# Altium schematic sheet MODEM.SchDoc: RF
size 420 x 297 mm; SheetNumber: 4
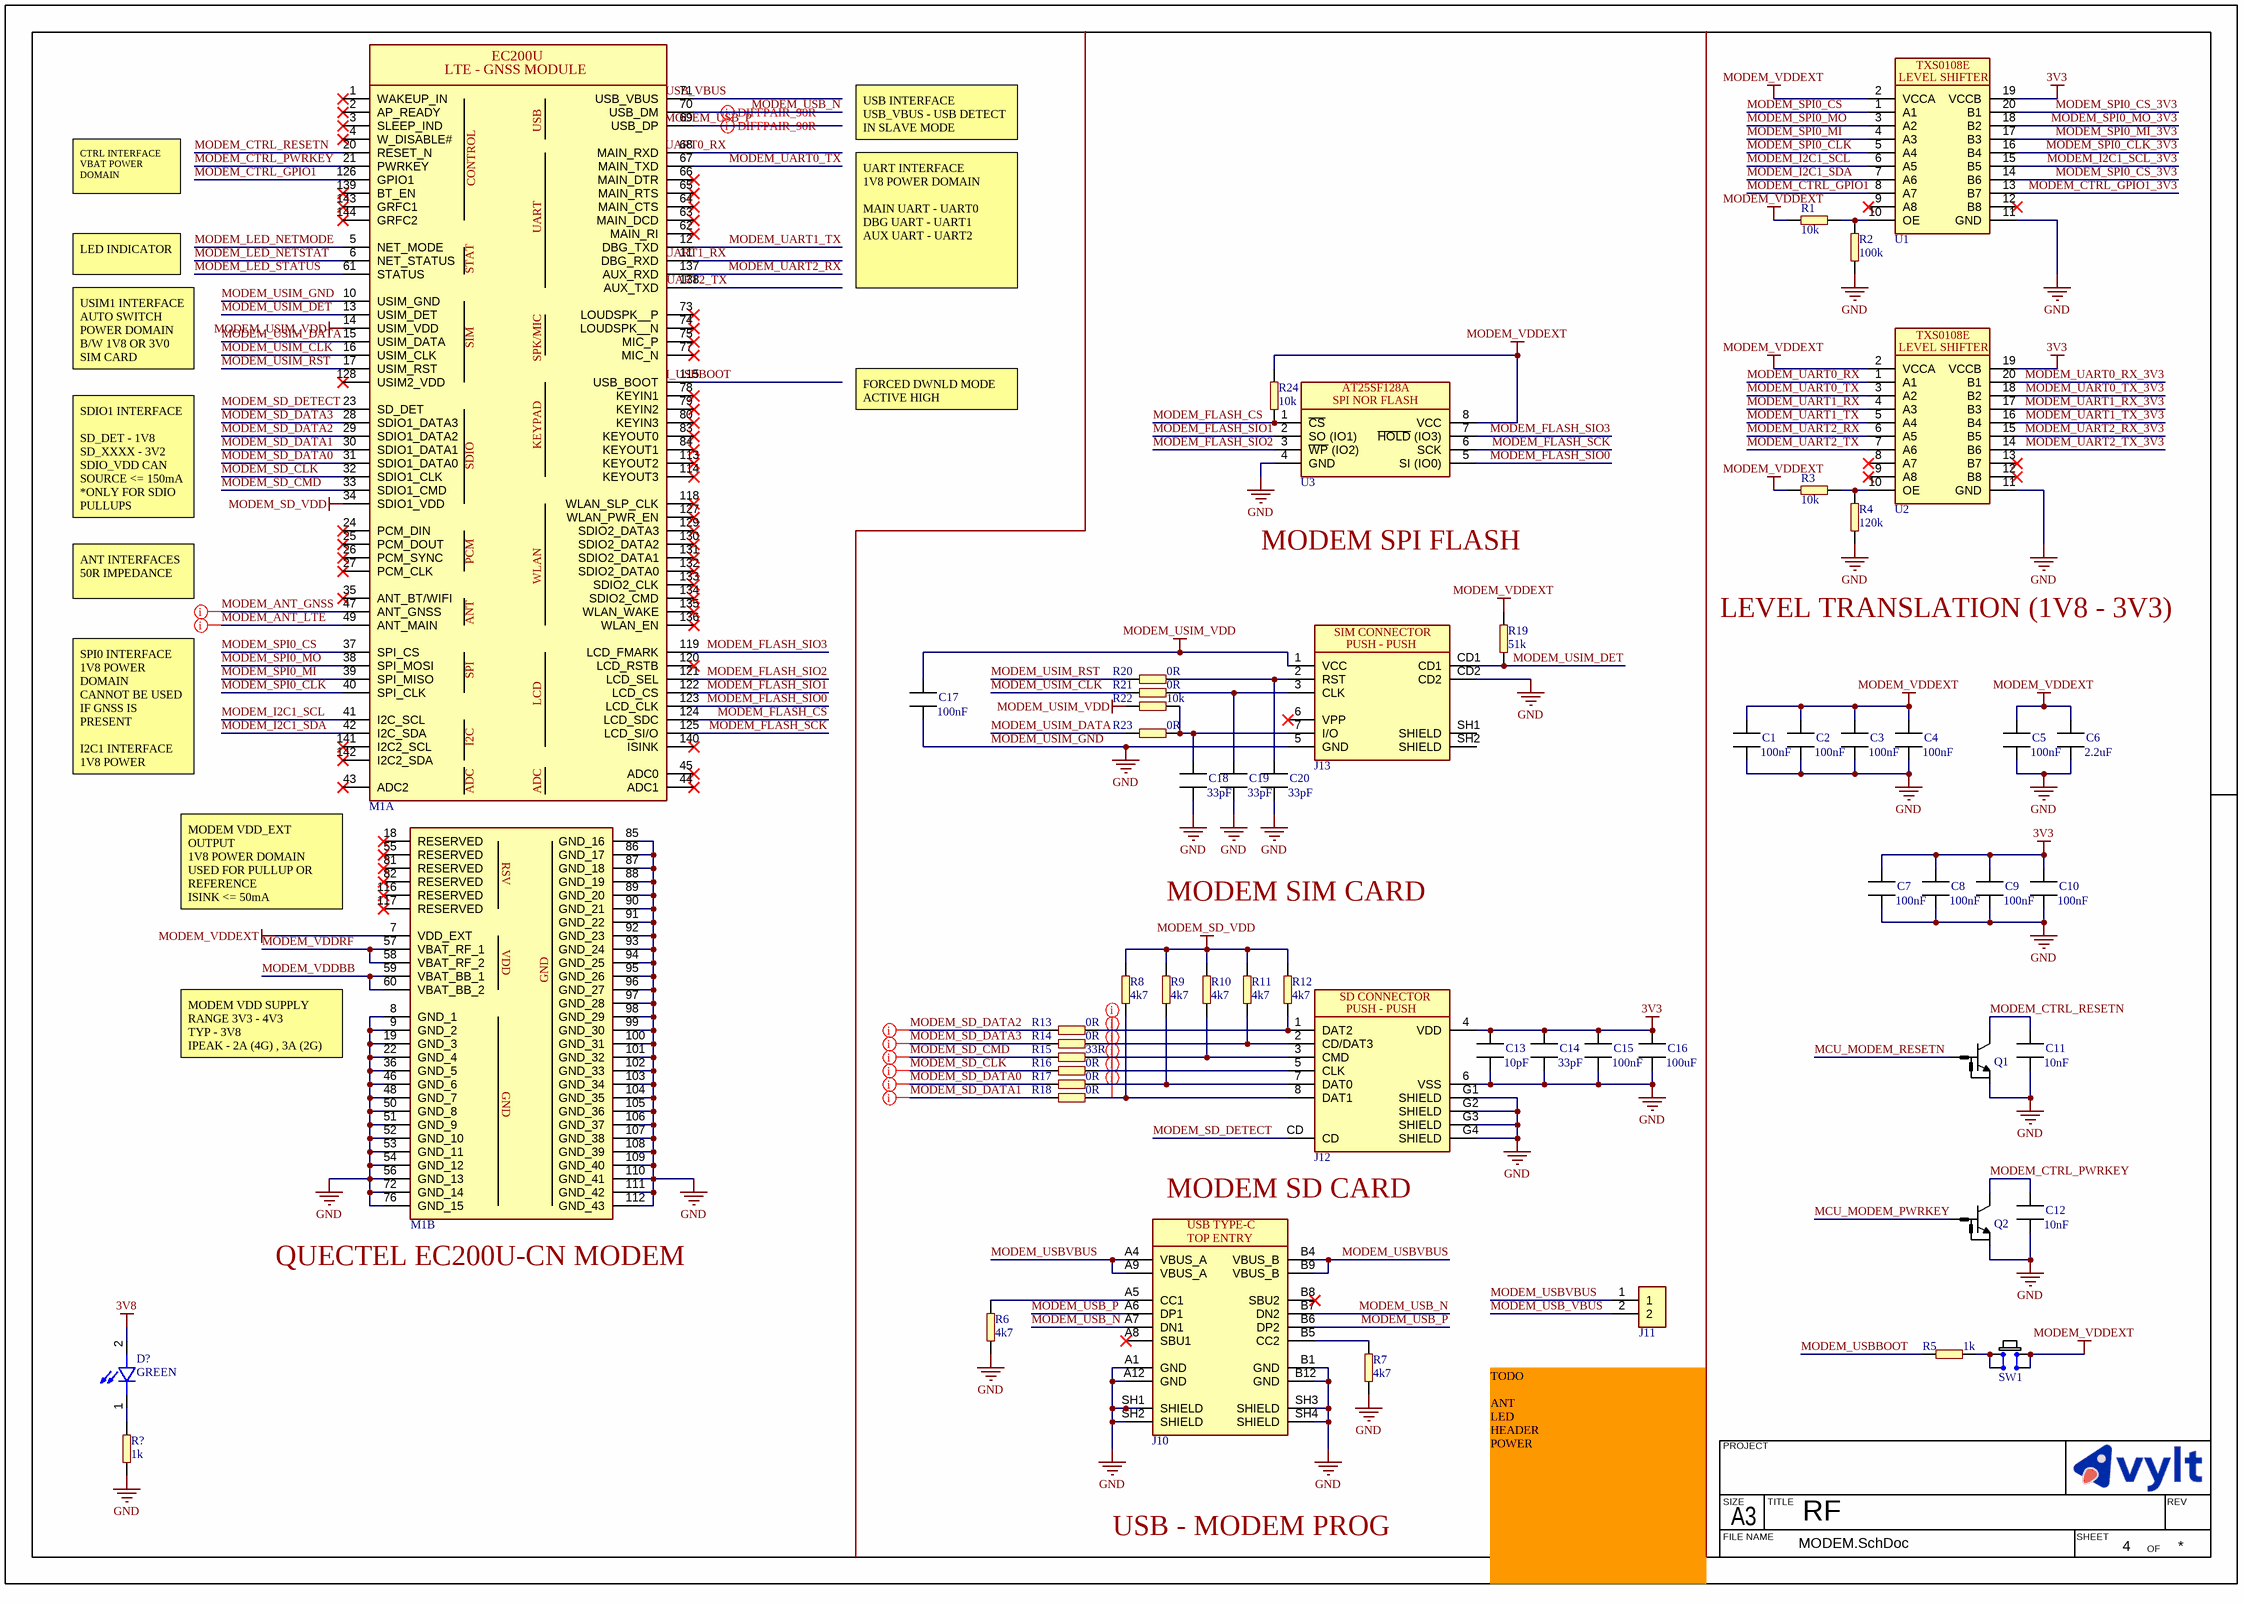
[diagram p0: MODEM.SchDoc]

## Parts
C1  value 100nF  [CAPC2012X13L]  (hidden comment: MLCC_0805)
C2  value 100nF  [CAPC2012X13L]  (hidden comment: MLCC_0805)
C3  value 100nF  [CAPC2012X13L]  (hidden comment: MLCC_0805)
C4  value 100nF  [CAPC2012X13L]  (hidden comment: MLCC_0805)
C5  value 100nF  [CAPC2012X13L]  (hidden comment: MLCC_0805)
C6  value 2.2uF  [CAPC2012X13L]  (hidden comment: MLCC_0805)
C7  value 100nF  [CAPC2012X13L]  (hidden comment: MLCC_0805)
C8  value 100nF  [CAPC2012X13L]  (hidden comment: MLCC_0805)
C9  value 100nF  [CAPC2012X13L]  (hidden comment: MLCC_0805)
C10  value 100nF  [CAPC2012X13L]  (hidden comment: MLCC_0805)
C11  value 10nF  [CAPC2012X13L]  (hidden comment: MLCC_0805)
C12  value 10nF  [CAPC2012X13L]  (hidden comment: MLCC_0805)
C13  value 10pF  [CAPC2012X13L]  (hidden comment: MLCC_0805)
C14  value 33pF  [CAPC2012X13L]  (hidden comment: MLCC_0805)
C15  value 100nF  [CAPC2012X13L]  (hidden comment: MLCC_0805)
C16  value 100uF  [CAPC2012X13L]  (hidden comment: MLCC_0805)
C17  value 100nF  [CAPC2012X13L]  (hidden comment: MLCC_0805)
C18  value 33pF  [CAPC2012X13L]  (hidden comment: MLCC_0805)
C19  value 33pF  [CAPC2012X13L]  (hidden comment: MLCC_0805)
C20  value 33pF  [CAPC2012X13L]  (hidden comment: MLCC_0805)
D?  value GREEN  [LED_1206_TOP]  (hidden comment: LED_1206_TOP)
J10  GSB1CA11101DSHR  [GSB1CA11101DSHR]  (value not drawn)
J11  2PX1R  [2PX1R]  (value not drawn)
J12  MSD-4-A  [MSD-4-A]  (value not drawn)
J13  SIM-11-A  [SIM-11-A]  (value not drawn)
M1  EC200U  [EC200U]  (value not drawn)  (parts A,B of 2)
Q1  PDTD143  [SOT95P230X110-3L]  (value not drawn)
Q2  PDTD143  [SOT95P230X110-3L]  (value not drawn)
R1  value 10k  [RES_0603]  (hidden comment: ERP_101-1)
R2  value 100k  [RES_0603]  (hidden comment: ERP_101-1)
R3  value 10k  [RES_0603]  (hidden comment: ERP_101-1)
R4  value 120k  [RES_0603]  (hidden comment: ERP_101-1)
R5  value 1k  [RES_0603]  (hidden comment: ERP_101-1)
R6  value 4k7  [RES_0603]  (hidden comment: ERP_101-1)
R7  value 4k7  [RES_0603]  (hidden comment: ERP_101-1)
R8  value 4k7  [RES_0603]  (hidden comment: ERP_101-1)
R9  value 4k7  [RES_0603]  (hidden comment: ERP_101-1)
R10  value 4k7  [RES_0603]  (hidden comment: ERP_101-1)
R11  value 4k7  [RES_0603]  (hidden comment: ERP_101-1)
R12  value 4k7  [RES_0603]  (hidden comment: ERP_101-1)
R13  value 0R  [RES_0603]  (hidden comment: ERP_101-1)
R14  value 0R  [RES_0603]  (hidden comment: ERP_101-1)
R15  value 33R  [RES_0603]  (hidden comment: ERP_101-1)
R16  value 0R  [RES_0603]  (hidden comment: ERP_101-1)
R17  value 0R  [RES_0603]  (hidden comment: ERP_101-1)
R18  value 0R  [RES_0603]  (hidden comment: ERP_101-1)
R19  value 51k  [RES_0603]  (hidden comment: ERP_101-1)
R20  value 0R  [RES_0603]  (hidden comment: ERP_101-1)
R21  value 0R  [RES_0603]  (hidden comment: ERP_101-1)
R22  value 10k  [RES_0603]  (hidden comment: ERP_101-1)
R23  value 0R  [RES_0603]  (hidden comment: ERP_101-1)
R24  value 10k  [RES_0603]  (hidden comment: ERP_101-1)
R?  value 1k  [RES_0603]  (hidden comment: ERP_101-1)
SW1  PTS647  [PTS647]  (value not drawn)
U1  TXS0108EPW  [TXS0108EPW]  (value not drawn)
U2  TXS0108EPW  [TXS0108EPW]  (value not drawn)
U3  AT25SF128A  [SOIC127P800X216-8L]  (value not drawn)

## Nets
3V3: C7.1 C8.1 C9.1 C10.1 C13.1 C14.1 C15.1 C16.1 J12.4(VDD) U1.19(VCCB) U2.19(VCCB)
3V8: D?.2
MODEM_SD_VDD: M1.34(SDIO1_VDD) R8.2 R9.2 R10.2 R11.2 R12.2
MODEM_USIM_GND: C1.2 C2.2 C3.2 C4.2 C5.2 C6.2 C7.2 C8.2 C9.2 C10.2 C11.2 C12.2 C13.2 C14.2 C15.2 C16.2 C17.2 C18.2 C19.2 C20.2 J10.A1(GND) J10.A12(GND) J10.B1(GND) J10.B12(GND) J10.SH1(SHIELD) J10.SH2(SHIELD) J10.SH3(SHIELD) J10.SH4(SHIELD) J12.6(VSS) J12.G1(SHIELD) J12.G2(SHIELD) J12.G3(SHIELD) J12.G4(SHIELD) J13.5(GND) J13.CD2 M1.8(GND_1) M1.9(GND_2) M1.10(USIM_GND) M1.19(GND_3) M1.22(GND_4) M1.36(GND_5) M1.46(GND_6) M1.48(GND_7) M1.50(GND_8) M1.51(GND_9) M1.52(GND_10) M1.53(GND_11) M1.54(GND_12) M1.56(GND_13) M1.72(GND_14) M1.76(GND_15) M1.85(GND_16) M1.86(GND_17) M1.87(GND_18) M1.88(GND_19) M1.89(GND_20) M1.90(GND_21) M1.91(GND_22) M1.92(GND_23) M1.93(GND_24) M1.94(GND_25) M1.95(GND_26) M1.96(GND_27) M1.97(GND_28) M1.98(GND_29) M1.99(GND_30) M1.100(GND_31) M1.101(GND_32) M1.102(GND_33) M1.103(GND_34) M1.104(GND_35) M1.105(GND_36) M1.106(GND_37) M1.107(GND_38) M1.108(GND_39) M1.109(GND_40) M1.110(GND_41) M1.111(GND_42) M1.112(GND_43) Q1.2 Q2.2 R2.2 R4.2 R6.2 R7.2 R?.1 U1.11(GND) U2.11(GND) U3.4(GND)  [also labelled GND]
MODEM_USIM_VDD: C17.1 J13.1(VCC) M1.14(USIM_VDD) R22.2
MODEM_VDDEXT: C1.1 C2.1 C3.1 C4.1 C5.1 C6.1 M1.7(VDD_EXT) R1.2 R3.2 R19.2 R24.2 SW1.3(COM) SW1.4(COM) U1.2(VCCA) U2.2(VCCA) U3.8(VCC)
MCU_MODEM_PWRKEY: Q2.1
MCU_MODEM_RESETN: Q1.1
MODEM_ANT_GNSS: M1.47(ANT_GNSS)
MODEM_ANT_LTE: M1.49(ANT_MAIN)
MODEM_CTRL_GPIO1: M1.126(GPIO1) U1.8(A7)
MODEM_CTRL_GPIO1_3V3: U1.13(B7)
MODEM_CTRL_PWRKEY: C12.1 M1.21(PWRKEY) Q2.3
MODEM_CTRL_RESETN: C11.1 M1.20(RESET_N) Q1.3
MODEM_FLASH_CS: M1.124(LCD_SDC) R24.1 U3.1(~{CS})
MODEM_FLASH_SCK: M1.125(LCD_SI/O) U3.6(SCK)
MODEM_FLASH_SIO0: M1.123(LCD_CLK) U3.5(SI_(IO0))
MODEM_FLASH_SIO1: M1.122(LCD_CS) U3.2(SO_(IO1))
MODEM_FLASH_SIO2: M1.121(LCD_SEL) U3.3(~{WP}_(IO2))
MODEM_FLASH_SIO3: M1.119(LCD_FMARK) U3.7(~{HOLD}_(IO3))
MODEM_I2C1_SCL: M1.41(I2C_SCL) U1.6(A5)
MODEM_I2C1_SCL_3V3: U1.15(B5)
MODEM_I2C1_SDA: M1.42(I2C_SDA) U1.7(A6)
MODEM_LED_NETMODE: M1.5(NET_MODE)
MODEM_LED_NETSTAT: M1.6(NET_STATUS)
MODEM_LED_STATUS: M1.61(STATUS)
MODEM_SD_CLK: M1.32(SDIO1_CLK) R16.2
MODEM_SD_CMD: M1.33(SDIO1_CMD) R15.2
MODEM_SD_DATA0: M1.31(SDIO1_DATA0) R17.2
MODEM_SD_DATA1: M1.30(SDIO1_DATA1) R18.2
MODEM_SD_DATA2: M1.29(SDIO1_DATA2) R13.2
MODEM_SD_DATA3: M1.28(SDIO1_DATA3) R14.2
MODEM_SD_DETECT: J12.CD M1.23(SD_DET)
MODEM_SPI0_CLK: M1.40(SPI_CLK) U1.5(A4)
MODEM_SPI0_CLK_3V3: U1.16(B4)
MODEM_SPI0_CS: M1.37(SPI_CS) U1.1(A1)
MODEM_SPI0_CS_3V3: U1.14(B6) U1.20(B1)
MODEM_SPI0_MI: M1.39(SPI_MISO) U1.4(A3)
MODEM_SPI0_MI_3V3: U1.17(B3)
MODEM_SPI0_MO: M1.38(SPI_MOSI) U1.3(A2)
MODEM_SPI0_MO_3V3: U1.18(B2)
MODEM_UART0_RX: M1.68(MAIN_RXD) U2.1(A1)
MODEM_UART0_RX_3V3: U2.20(B1)
MODEM_UART0_TX: M1.67(MAIN_TXD) U2.3(A2)
MODEM_UART0_TX_3V3: U2.18(B2)
MODEM_UART1_RX: M1.11(DBG_RXD) U2.4(A3)
MODEM_UART1_RX_3V3: U2.17(B3)
MODEM_UART1_TX: M1.12(DBG_TXD) U2.5(A4)
MODEM_UART1_TX_3V3: U2.16(B4)
MODEM_UART2_RX: M1.137(AUX_RXD) U2.6(A5)
MODEM_UART2_RX_3V3: U2.15(B5)
MODEM_UART2_TX: M1.138(AUX_TXD) U2.7(A6)
MODEM_UART2_TX_3V3: U2.14(B6)
MODEM_USB_N: J10.A7(DN1) J10.B7(DN2) M1.70(USB_DM)
MODEM_USB_P: J10.A6(DP1) J10.B6(DP2) M1.69(USB_DP)
MODEM_USB_VBUS: J11.2 M1.71(USB_VBUS)
MODEM_USBBOOT: M1.115(USB_BOOT) R5.2
MODEM_USBVBUS: J10.A4(VBUS_A) J10.A9(VBUS_A) J10.B4(VBUS_B) J10.B9(VBUS_B) J11.1
MODEM_USIM_CLK: M1.16(USIM_CLK) R21.2
MODEM_USIM_DATA: M1.15(USIM_DATA) R23.2
MODEM_USIM_DET: J13.CD1 M1.13(USIM_DET) R19.1
MODEM_USIM_RST: M1.17(USIM_RST) R20.2
MODEM_VDDBB: M1.59(VBAT_BB_1) M1.60(VBAT_BB_2)
MODEM_VDDRF: M1.57(VBAT_RF_1) M1.58(VBAT_RF_2)
NetC18_1: C18.1 J13.7(I/O) R22.1 R23.1
NetC19_1: C19.1 J13.3(CLK) R21.1
NetC20_1: C20.1 J13.2(RST) R20.1
NetD?_1: D?.1 R?.2
NetJ10_A5: J10.A5(CC1) R6.1
NetJ10_B5: J10.B5(CC2) R7.1
NetJ12_1: J12.1(DAT2) R12.1 R13.1
NetJ12_2: J12.2(CD/DAT3) R11.1 R14.1
NetJ12_3: J12.3(CMD) R10.1 R15.1
NetJ12_5: J12.5(CLK) R16.1
NetJ12_7: J12.7(DAT0) R9.1 R17.1
NetJ12_8: J12.8(DAT1) R8.1 R18.1
NetR1_1: R1.1 R2.1 U1.10(OE)
NetR3_1: R3.1 R4.1 U2.10(OE)
NetR5_1: R5.1 SW1.1(NO) SW1.2(NO)

Not connected (* = marked no-connect by the designer): J10 A8(SBU1)* B8(SBU2)*; J13 6(VPP)* SH1(SHIELD) SH2(SHIELD); M1 1(WAKEUP_IN)* 2(AP_READY)* 3(SLEEP_IND)* 4(W_DISABLE#)* 18(RESERVED)* 24(PCM_DIN)* 25(PCM_DOUT)* 26(PCM_SYNC)* 27(PCM_CLK)* 35(ANT_BT/WIFI)* 43(ADC2)* 44(ADC1)* 45(ADC0)* 55(RESERVED)* 62(MAIN_RI)* 63(MAIN_DCD)* 64(MAIN_CTS)* 65(MAIN_RTS)* 66(MAIN_DTR)* 73(LOUDSPK__P)* 74(LOUDSPK__N)* 75(MIC_P)* 77(MIC_N)* 78(KEYIN1)* 79(KEYIN2)* 80(KEYIN3)* 81(RESERVED)* 82(RESERVED)* 83(KEYOUT0)* 84(KEYOUT1)* 113(KEYOUT2)* 114(KEYOUT3)* 116(RESERVED)* 117(RESERVED)* 118(WLAN_SLP_CLK)* 120(LCD_RSTB)* 127(WLAN_PWR_EN)* 128(USIM2_VDD)* 129(SDIO2_DATA3)* 130(SDIO2_DATA2)* 131(SDIO2_DATA1)* 132(SDIO2_DATA0)* 133(SDIO2_CLK)* 134(SDIO2_CMD)* 135(WLAN_WAKE)* 136(WLAN_EN)* 139(BT_EN)* 140(ISINK)* 141(I2C2_SCL)* 142(I2C2_SDA)* 143(GRFC1)* 144(GRFC2)*; U1 9(A8)* 12(B8)*; U2 8(A7)* 9(A8)* 12(B8)* 13(B7)*

## Layout directives
differential pair; differential pair class USB_90R; rule Differential Pairs Routing [Pref Gap = 7mil    Min Gap  = 7mil    Max Gap  = 7milPref Width = 8.057mil    Min Width  = 8.057mil    Max Width  = 8.057mil]: MODEM_USB_N
differential pair; rule Differential Pairs Routing [Pref Gap = 7mil    Min Gap  = 7mil    Max Gap  = 7milPref Width = 8.057mil    Min Width  = 8.057mil    Max Width  = 8.057mil]; differential pair class USB_90R: MODEM_USB_P
net class ANT_50R; rule Width Constraint [Pref Impedance = 50.00ohms    Min Impedance = 50.00ohms    Max Impedance = 50.00ohms]: MODEM_ANT_GNSS, MODEM_ANT_LTE
rule Width Constraint [Pref Impedance = 50.00ohms    Min Impedance = 50.00ohms    Max Impedance = 50.00ohms]: MODEM_SD_CLK, MODEM_SD_CMD, MODEM_SD_DATA0, MODEM_SD_DATA1, MODEM_SD_DATA2, MODEM_SD_DATA3, NetJ12_1, NetJ12_2, NetJ12_3, NetJ12_5, NetJ12_7, NetJ12_8

## Notes on the sheet
- CTRL INTERFACE
  VBAT POWER DOMAIN
- USB INTERFACE
  USB_VBUS - USB DETECT IN SLAVE MODE
- LED INDICATOR
- UART INTERFACE
  1V8 POWER DOMAIN
  MAIN UART - UART0
  DBG UART - UART1
  AUX UART - UART2
- USIM1 INTERFACE
  AUTO SWITCH POWER DOMAIN B/W 1V8 OR 3V0 SIM CARD
- FORCED DWNLD MODE
  ACTIVE HIGH
- SDIO1 INTERFACE
  SD_DET - 1V8
  SD_XXXX - 3V2
  SDIO_VDD CAN SOURCE <= 150mA
  *ONLY FOR SDIO PULLUPS
- ANT INTERFACES
  50R IMPEDANCE
- MODEM SPI FLASH
- LEVEL TRANSLATION (1V8 - 3V3)
- SPI0 INTERFACE
  1V8 POWER DOMAIN
  CANNOT BE USED IF GNSS IS PRESENT
  I2C1 INTERFACE
  1V8 POWER DOMAIN
- (near M1) MODEM VDD_EXT OUTPUT
  1V8 POWER DOMAIN
  USED FOR PULLUP OR REFERENCE
  ISINK <= 50mA
- MODEM SIM CARD
- MODEM VDD SUPPLY
  RANGE 3V3 - 4V3
  TYP - 3V8
  IPEAK - 2A (4G) , 3A (2G)
- MODEM SD CARD
- (near M1) QUECTEL EC200U-CN MODEM
- USB - MODEM PROG
- TODO
  ANT
  LED
  HEADER
  POWER
- PROJECT
- SIZE
- FILE NAME
- A3
- TITLE
- SHEET
- OF
- REV
- (in symbol AT25SF128A) SPI NOR FLASH
- (in symbol EC200U, part A) LTE - GNSS MODULE; USB; CONTROL; UART; STAT; SIM; SPK/MIC; KEYPAD; SDIO; PCM; WLAN; ANT; SPI; LCD; I2C; ADC
- (in symbol EC200U, part B) RSV; VDD; GND
- (in symbol GSB1CA11101DSHR) USB TYPE-C; TOP ENTRY
- (in symbol MSD-4-A) SD CONNECTOR; PUSH - PUSH
- (in symbol SIM-11-A) SIM CONNECTOR; PUSH - PUSH
- (in symbol TXS0108EPW) TXS0108E; LEVEL SHIFTER

## Library data of the parts
C1-C20 = MLCC_0805: Chip Capacitor, 2-Leads, Body 2.00x1.25mm, IPC High Density; Package: 0805; Manufacturer 1: *; Manufacturer Part Number 1: *
D? = LED_1206_TOP: LED CLEAR 1206 SMD; Manufacturer Part Number 1: 156120VS82500P; Manufacturer 1: Würth Elektronik
J10 = GSB1CA11101DSHR: USB-C (USB TYPE-C) USB 2.0 Receptacle Connector 24 (16+8 Dummy) Position Surface Mount, Through Hole; Manufacturer 1: Amphenol ICC (Commercial Products); Manufacturer Part Number 1: GSB1CA11101DSHR; Package: 24 (16+8 Dummy); Value: *
J12 = MSD-4-A: 9 (8 + 1) Position Card Connector microSD™ Surface Mount, Right Angle Gold; Manufacturer 1: Same Sky; Manufacturer Part Number 1: MSD-4-A; Package: 9 (8+1); Value: *
J13 = SIM-11-A: 8 (6 + 2) Position Card Connector SIM Card Surface Mount, Right Angle Gold; Manufacturer 1: Same Sky; Manufacturer Part Number 1: SIM-11-A; Package: 8 (6 + 2); Value: *
M1 = EC200U: LTE CAT1 MODEM 144 SMD; Manufacturer 1: Quectel; Manufacturer Part Number 1: EC200U-CN; Value: *
Q1 Q2 = PDTD143: Pre-Biased Bipolar Transistor (BJT) NPN - Pre-Biased 50 V 500 mA 225 MHz 320 mW Surface Mount TO-236AB; Manufacturer Part Number 1: PDTD143ETR; Manufacturer 1: Nexperia USA Inc.; Package: SOT-23-3; Value: *
R1-R24 R? = RES_0603: Package: 0603; Manufacturer 1: *; Manufacturer Part Number 1: *
  R?: ERP: *
SW1 = PTS647: Tactile Switch SPST-NO Top Actuated Surface Mount; Manufacturer Part Number 1: PTS 647 SN50 SMTR2 LFS; Manufacturer 1: C&K; Package: 4.5X4.5
U1 U2 = TXS0108EPW: Voltage Level Translator Bidirectional 1 Circuit 8 Channel 60Mbps 20-TSSOP; Manufacturer Part Number 1: TXS0108EPWR; Manufacturer 1: Texas Instruments; Package: 20-TSSOP; Value: *
U3 = AT25SF128A: FLASH - NOR Memory IC SPI - Quad I/O 133 MHz 8-SOIC; Manufacturer 1: Renesas Electronics Corporation; Manufacturer Part Number 1: AT25SF128A-SHB-T; Package: 8-SOIC; Value: *